# EAGLE board CC-Multi-Pak (EAGLE 5.10)
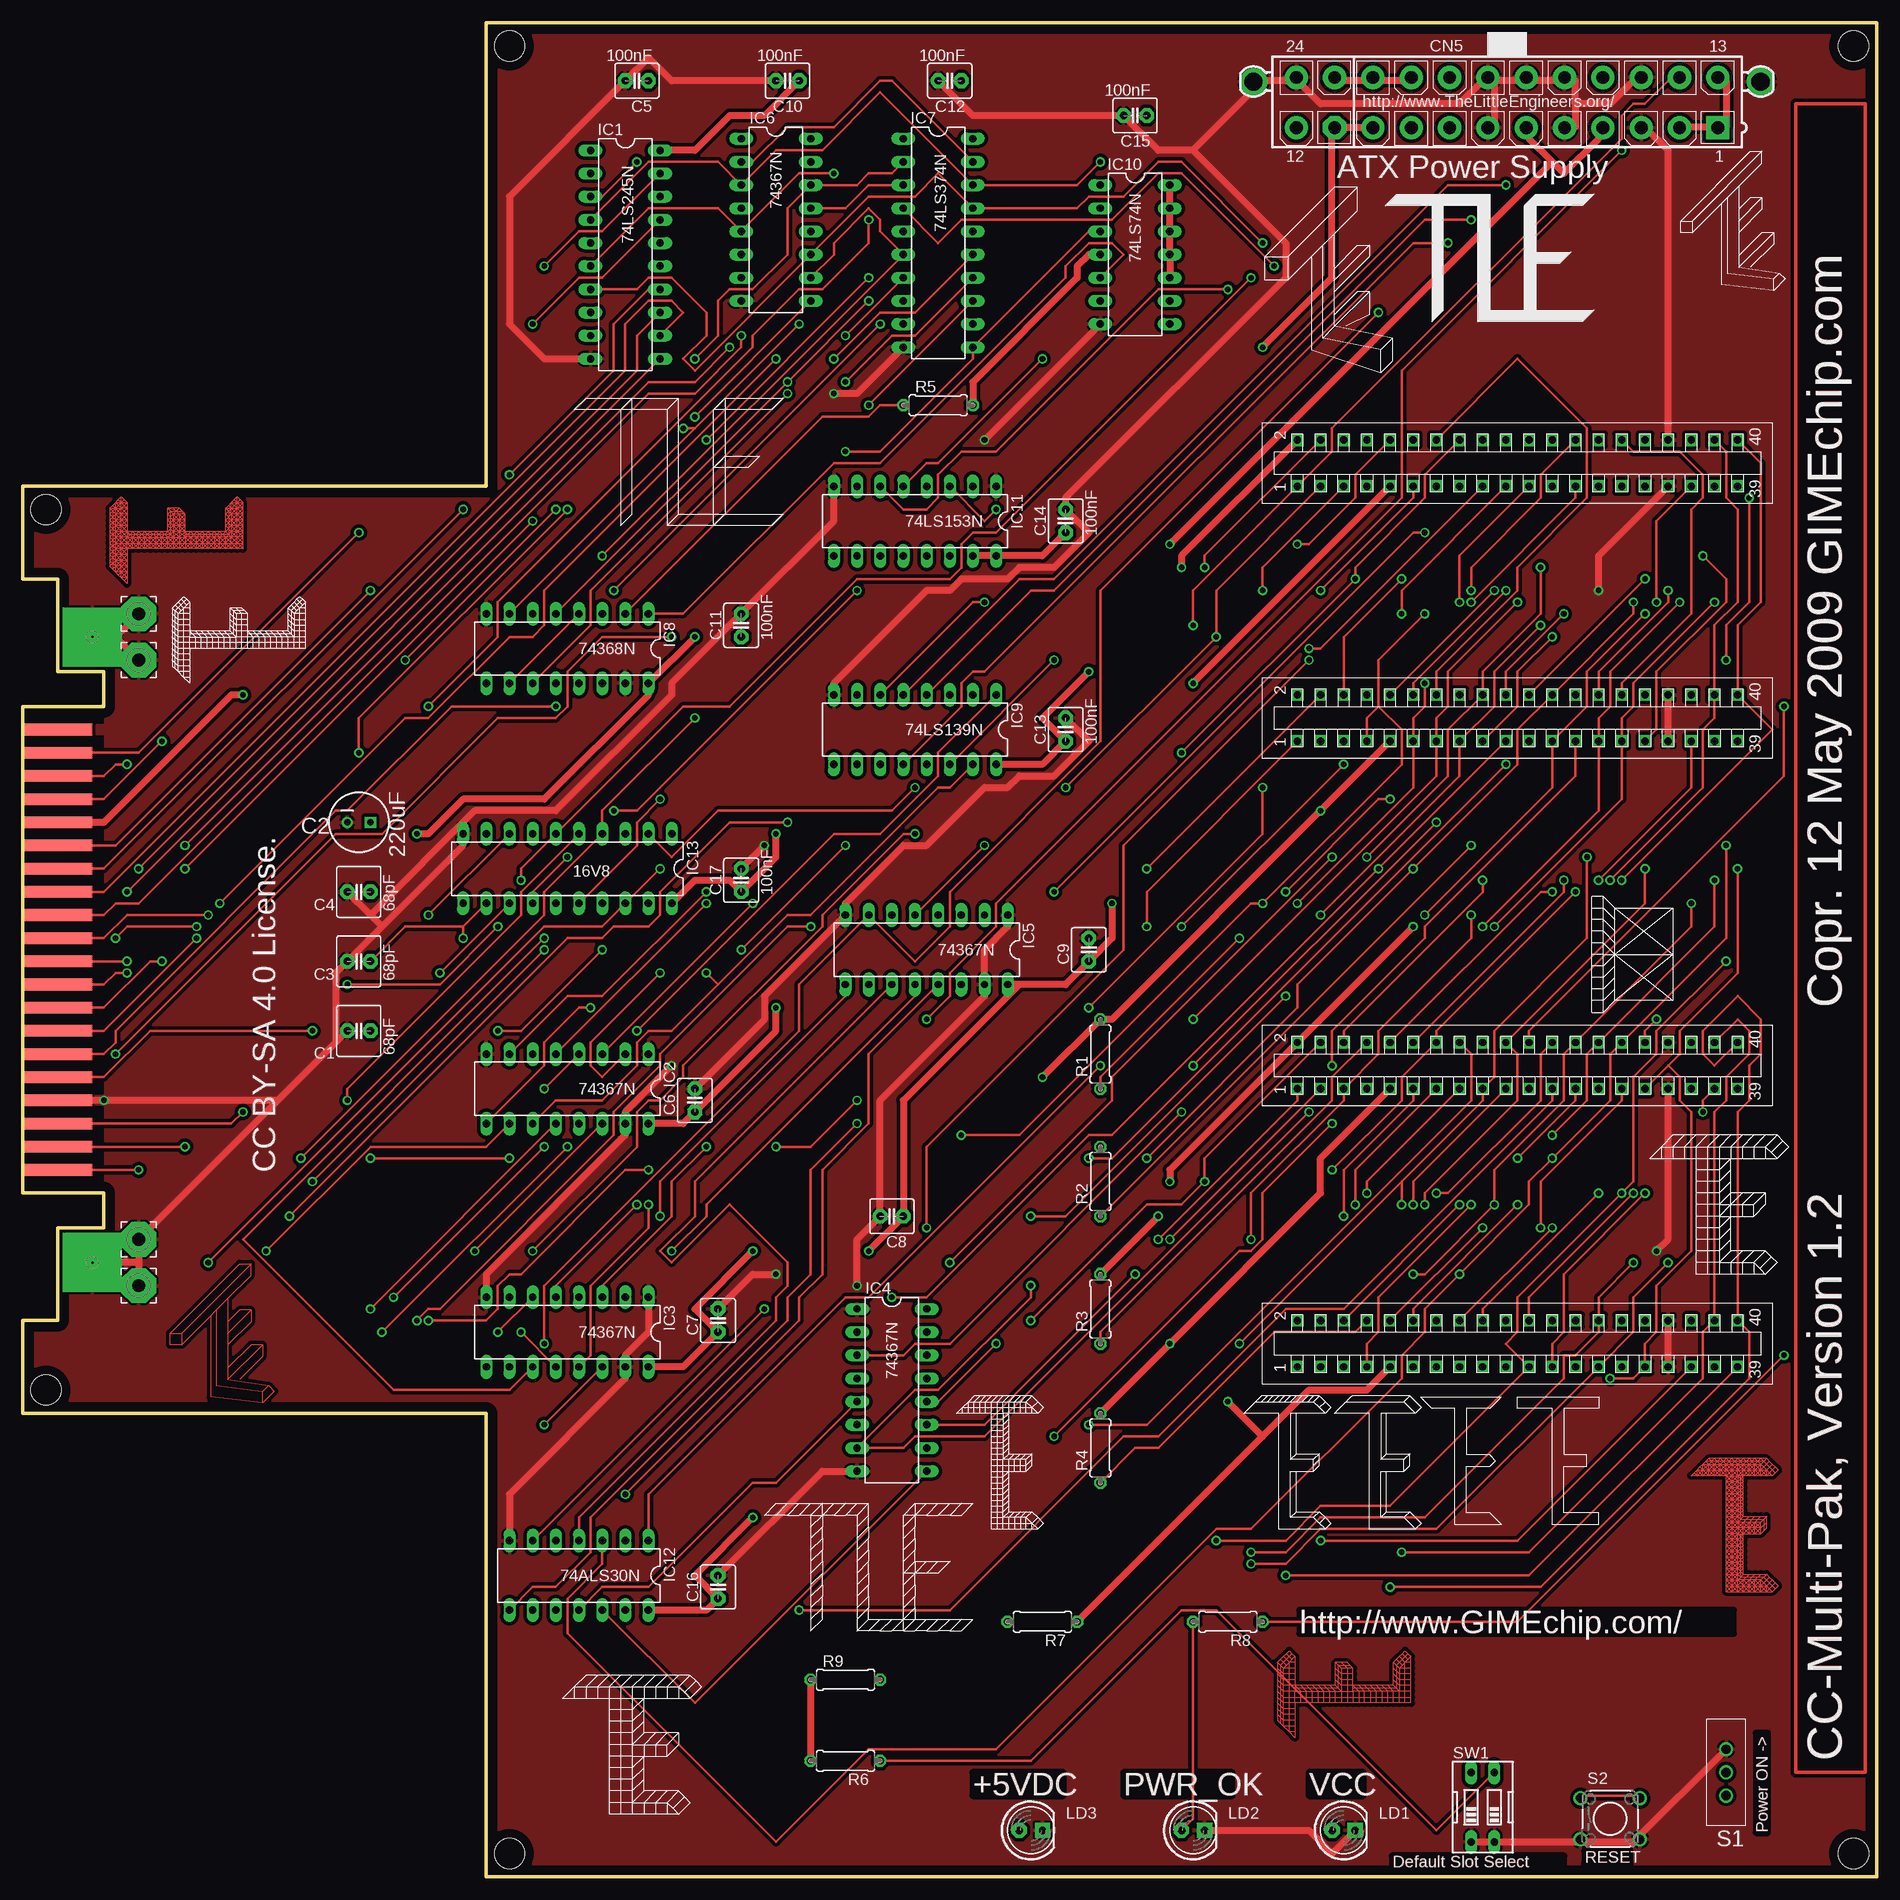
[diagram p8: board, top side]
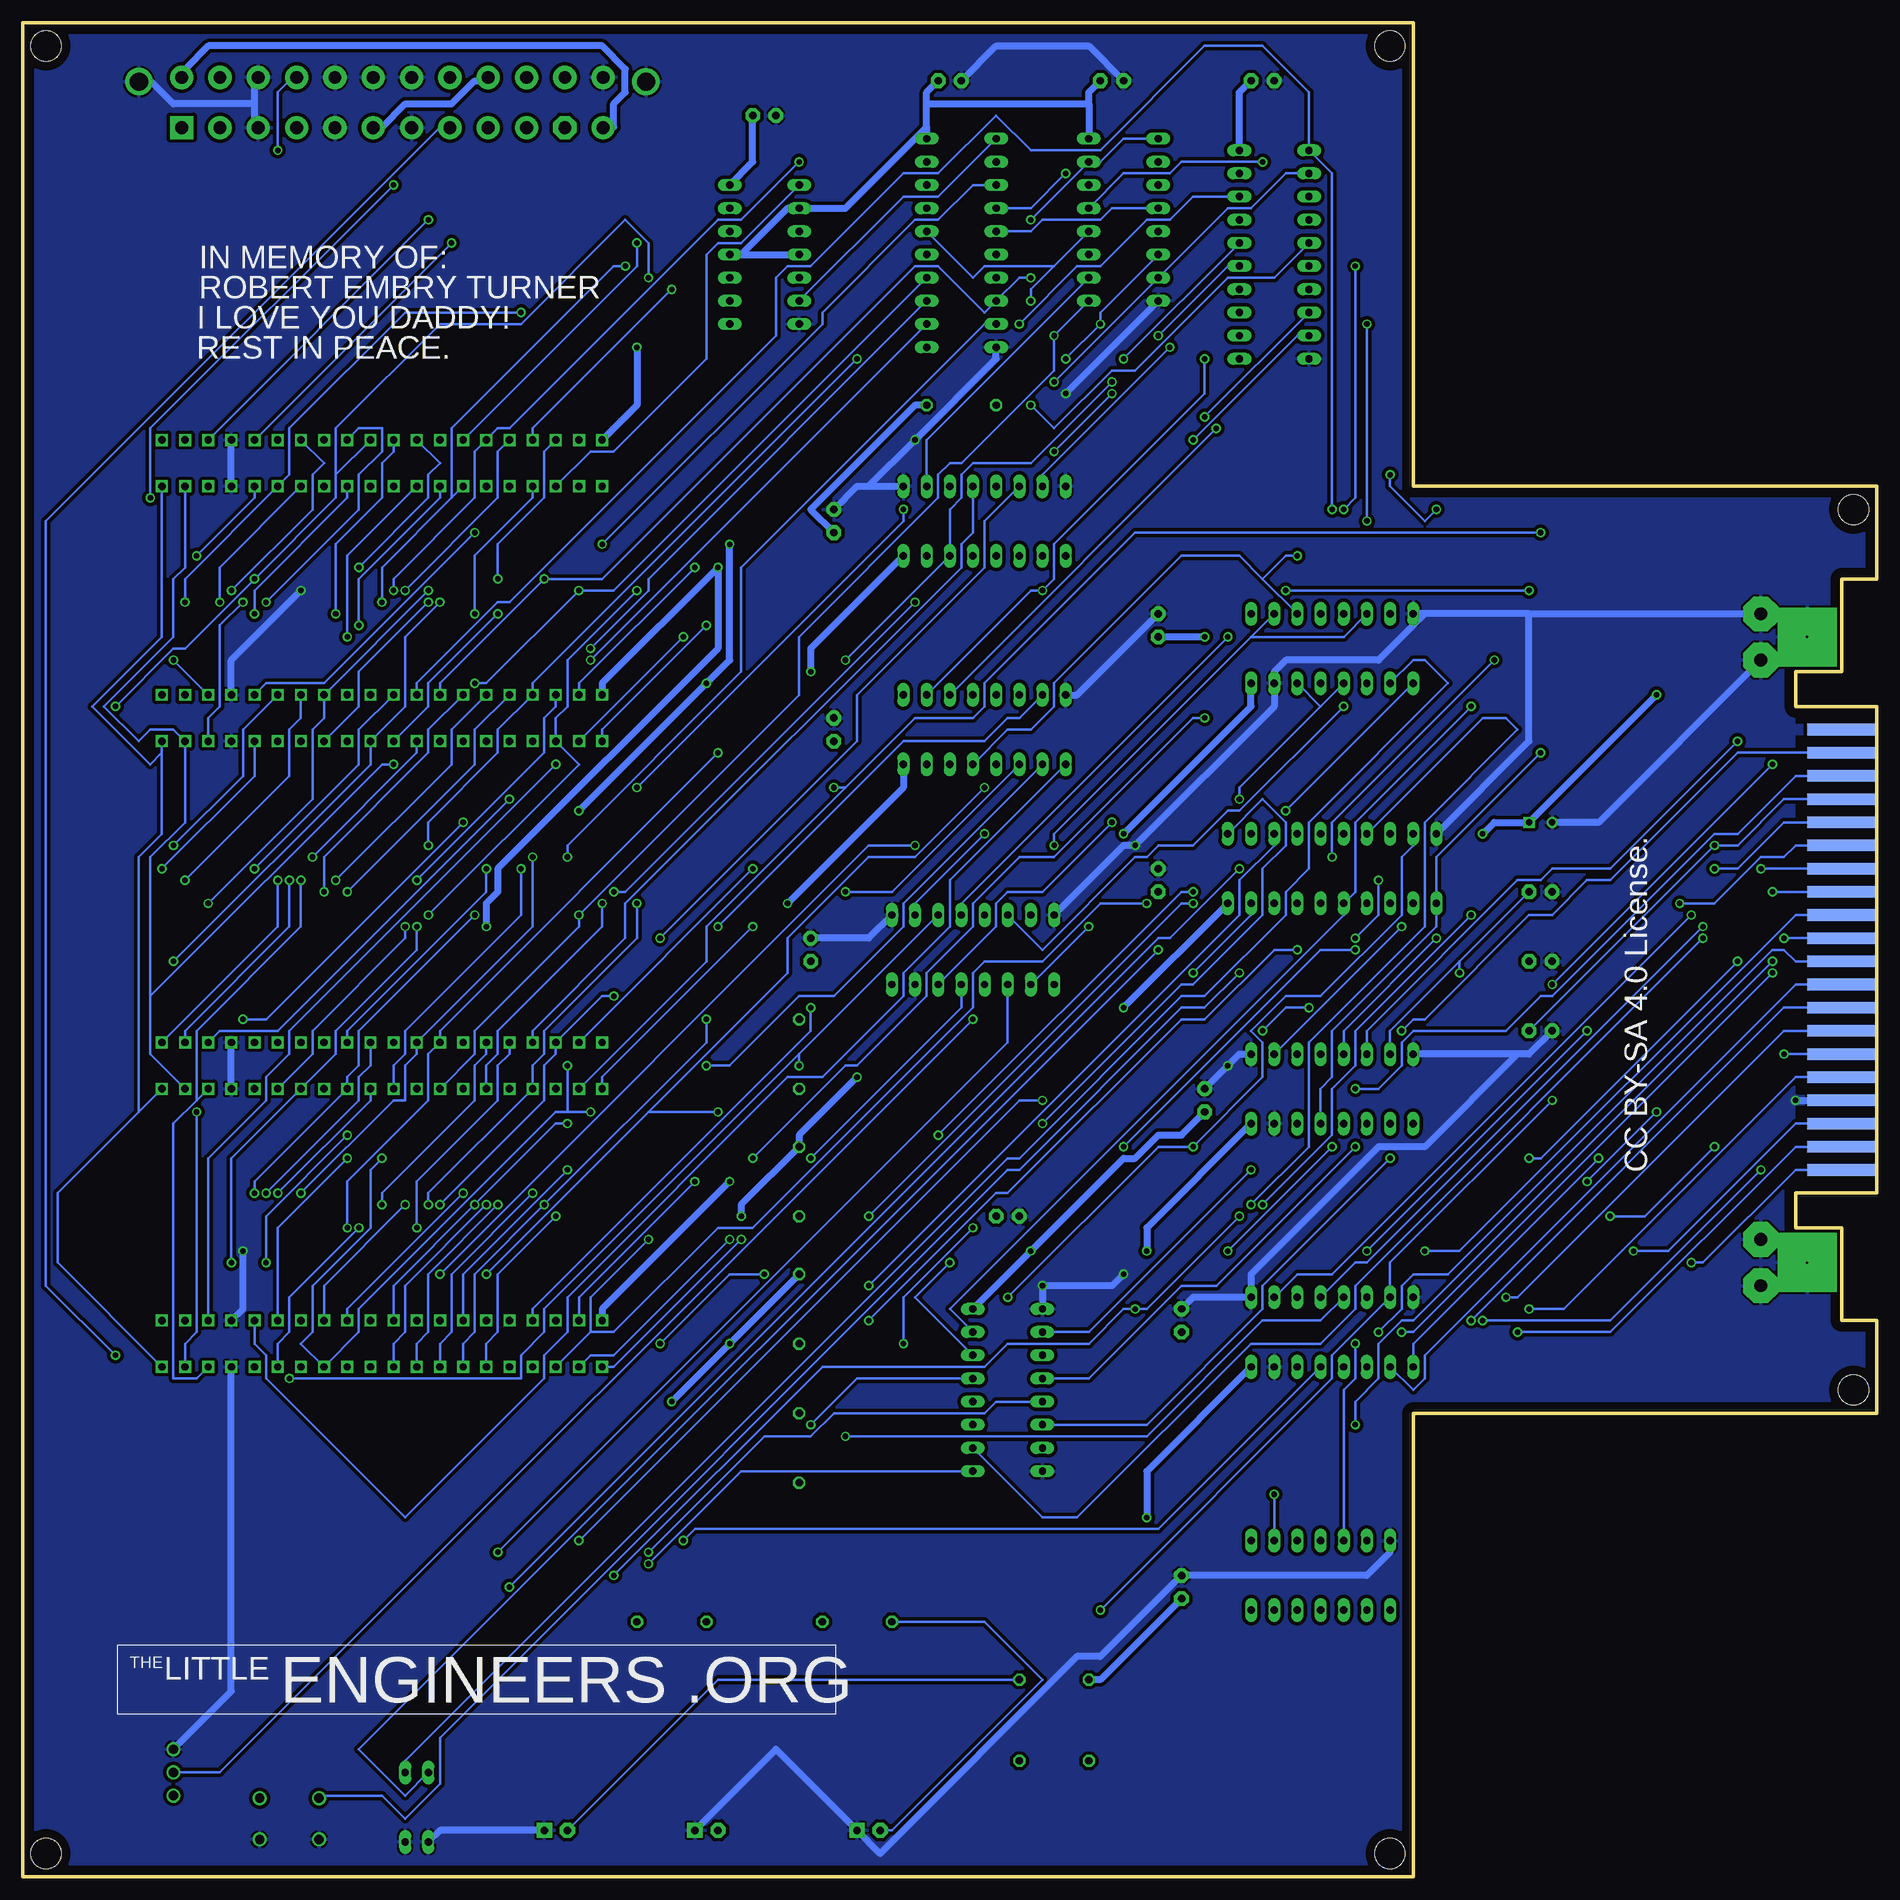
[diagram p9: board, bottom side, seen from below]

Size 203.2 x 203.2 mm. Coordinates in mm from the lower left corner, seen from the top.
Outline: 8.89,71.12 8.89,74.93 0,74.93 0,128.27 8.89,128.27 8.89,132.08 3.81,132.08 3.81,142.24 0,142.24 0,152.4 50.8,152.4 50.8,203.2 203.2,203.2 203.2,0 50.8,0 50.8,50.8 0,50.8 0,60.96 3.81,60.96 3.81,71.12 8.89,71.12
Copper layers (1*16): Top 0.035mm / dielectric 1.5mm / Bottom 0.035mm
Design rules "default": minimum track width 10mil, minimum drill 24mil, track to track 8mil, track to pad 8mil, pad to pad 8mil, via to via 8mil, smd to smd 8mil, copper to edge 40mil, drill to drill 8mil, minimum pad ring 10mil, minimum via ring 8mil, stop-mask expansion 4mil, vias tented up to drill 0mil, thermal gap 10mil
Net classes: 0 default: width 0.254 mm, drill 0.508 mm, clearance 0.254 mm; 1 vcc: width 0.762 mm, drill 0.508 mm, clearance 0.381 mm; 2 gnd: width 0.762 mm, drill 0.508 mm, clearance 0.381 mm; 3 12v: width 0.762 mm, drill 0.508 mm, clearance 0.381 mm; 4 -12v: width 0.762 mm, drill 0.508 mm, clearance 0.381 mm; 5 3.3v: width 0.762 mm, drill 0.508 mm, clearance 0.381 mm; 6 5v: width 0.762 mm, drill 0.381 mm, clearance 0.381 mm; 7 -5v: width 0.762 mm, drill 0.381 mm, clearance 0.381 mm

## Footprints (pad centres in the part's own frame; a part is rotated, then mirrored left to right if it is on the bottom)
C2.5-6 = drill 0.813 pad 1.6 octagon: 1 -1.27,0; 2 1.27,0
SPARKFUN_CPOL-RADIAL-100UF-25V = drill 0.7 square: 1 1.27,0 | drill 0.7 round: 2 -1.27,0
C2.5-4 = drill 0.813 pad 1.6 octagon: 1 -1.27,0; 2 1.27,0
EDGE-CON-40 = drill 0.8 square: P1 -6.35,22.86; P2 -1.27,22.86; P3 -6.35,20.32; P4 -1.27,20.32; P5 -6.35,17.78; P6 -1.27,17.78; P7 -6.35,15.24; P8 -1.27,15.24; P9 -6.35,12.7; P10 -1.27,12.7; P11 -6.35,10.16; P12 -1.27,10.16; P13 -6.35,7.62; P14 -1.27,7.62; P15 -6.35,5.08; P16 -1.27,5.08; P17 -6.35,2.54; P18 -1.27,2.54; P19 -6.35,0; P20 -1.27,0; P21 -6.35,-2.54; P22 -1.27,-2.54; P23 -6.35,-5.08; P24 -1.27,-5.08; P25 -6.35,-7.62; P26 -1.27,-7.62; P27 -6.35,-10.16; P28 -1.27,-10.16; P29 -6.35,-12.7; P30 -1.27,-12.7; P31 -6.35,-15.24; P32 -1.27,-15.24; P33 -6.35,-17.78; P34 -1.27,-17.78; P35 -6.35,-20.32; P36 -1.27,-20.32; P37 -6.35,-22.86; P38 -1.27,-22.86; P39 -6.35,-25.4; P40 -1.27,-25.4
ATX-UNIVERSAL = drill 1.4 pad 2.54 square: 1 23.227,-2.598 | drill 1.4 pad 2.54 round: 2 19.027,-2.598; 3 14.827,-2.598; 4 10.627,-2.598; 5 6.427,-2.598; 6 2.227,-2.598; 7 -1.973,-2.598; 8 -6.173,-2.598; 9 -10.373,-2.598; 10 -14.573,-2.598; 12 -22.973,-2.598; 13 23.227,2.902; 14 19.027,2.902; 15 14.827,2.902; 16 10.627,2.902; 17 6.427,2.902; 18 2.227,2.902; 19 -1.973,2.902; 20 -6.173,2.902; 21 -10.373,2.902; 22 -14.573,2.902; 23 -18.773,2.902; 24 -22.973,2.902 | drill 1.4 pad 2.54 octagon: 11 -18.773,-2.598 | drill 2 round: 25 -27.668,2.438; 26 27.922,2.441
SQUARE = drill 0.254 pad 6.452 square: GND 0,0
DIL20 = drill 0.813 long: 1 -11.43,-3.81; 2 -8.89,-3.81; 3 -6.35,-3.81; 4 -3.81,-3.81; 5 -1.27,-3.81; 6 1.27,-3.81; 7 3.81,-3.81; 8 6.35,-3.81; 9 8.89,-3.81; 10 11.43,-3.81; 11 11.43,3.81; 12 8.89,3.81; 13 6.35,3.81; 14 3.81,3.81; 15 1.27,3.81; 16 -1.27,3.81; 17 -3.81,3.81; 18 -6.35,3.81; 19 -8.89,3.81; 20 -11.43,3.81
DIL16 = drill 0.813 long: 1 -8.89,-3.81; 2 -6.35,-3.81; 3 -3.81,-3.81; 4 -1.27,-3.81; 5 1.27,-3.81; 6 3.81,-3.81; 7 6.35,-3.81; 8 8.89,-3.81; 9 8.89,3.81; 10 6.35,3.81; 11 3.81,3.81; 12 1.27,3.81; 13 -1.27,3.81; 14 -3.81,3.81; 15 -6.35,3.81; 16 -8.89,3.81
DIL14 = drill 0.813 long: 1 -7.62,-3.81; 2 -5.08,-3.81; 3 -2.54,-3.81; 4 0,-3.81; 5 2.54,-3.81; 6 5.08,-3.81; 7 7.62,-3.81; 8 7.62,3.81; 9 5.08,3.81; 10 2.54,3.81; 11 0,3.81; 12 -2.54,3.81; 13 -5.08,3.81; 14 -7.62,3.81
LED5MM = drill 0.813 pad 1.676 octagon: A -1.27,0 | drill 0.813 pad 1.676 square: K 1.27,0
3,81/1,4 = drill 1.397 pad 3.81 octagon: 1 0,0
0207/7 = drill 0.813 octagon: 1 -3.81,0; 2 3.81,0
SWITCH-SPST = drill 1.016 round: 1 0,2.54; 2 0,0; 3 0,-2.54
TACTILE-PTH = drill 1.016 round: 1 -3.251,2.261; 2 3.251,2.261; 3 -3.251,-2.261; 4 3.251,-2.261
DIPSWITCH-02 = drill 0.813 long: 1 -1.27,-3.81; 2 1.27,-3.81; 3 1.27,3.81; 4 -1.27,3.81
SERIALTECH_EDGE40 = smd 7.62 x 1.27: 1 0,24.13; 3 0,21.59; 5 0,19.05; 7 0,16.51; 9 0,13.97; 11 0,11.43; 13 0,8.89; 15 0,6.35; 17 0,3.81; 19 0,1.27; 21 0,-1.27; 23 0,-3.81; 25 0,-6.35; 27 0,-8.89; 29 0,-11.43; 31 0,-13.97; 33 0,-16.51; 35 0,-19.05; 37 0,-21.59; 39 0,-24.13 | smd 7.62 x 1.27 bottom: 2 0,24.13; 4 0,21.59; 6 0,19.05; 8 0,16.51; 10 0,13.97; 12 0,11.43; 14 0,8.89; 16 0,6.35; 18 0,3.81; 20 0,1.27; 22 0,-1.27; 24 0,-3.81; 26 0,-6.35; 28 0,-8.89; 30 0,-11.43; 32 0,-13.97; 34 0,-16.51; 36 0,-19.05; 38 0,-21.59; 40 0,-24.13
SPARKFUN_STAND-OFF = hole 3.302: 0,0

## Placement (x,y rotation side)
C1  68pF  [C2.5-6]  36.83,92.71 0 top
C2  220uF  [SPARKFUN_CPOL-RADIAL-100UF-25V]  36.83,115.57 0 top
C3  68pF  [C2.5-6]  36.83,100.33 180 top
C4  68pF  [C2.5-6]  36.83,107.95 180 top
C5  100nF  [C2.5-4]  67.31,196.85 180 top
C6  100nF  [C2.5-4]  73.66,85.09 90 top
C7  100nF  [C2.5-4]  76.2,60.96 90 top
C8  100nF  [C2.5-4]  95.25,72.39 180 top
C9  100nF  [C2.5-4]  116.84,101.6 90 top
C10  100nF  [C2.5-4]  83.82,196.85 180 top
C11  100nF  [C2.5-4]  78.74,137.16 90 top
C12  100nF  [C2.5-4]  101.6,196.85 180 top
C13  100nF  [C2.5-4]  114.3,125.73 90 top
C14  100nF  [C2.5-4]  114.3,148.59 90 top
C15  100nF  [C2.5-4]  121.92,193.04 180 top
C16  100nF  [C2.5-4]  76.2,31.75 90 top
C17  100nF  [C2.5-4]  78.74,109.22 90 top
CN1  DRAGON-CARD-EDGE  [EDGE-CON-40]  162.56,158.75 90 top
CN2  DRAGON-CARD-EDGE  [EDGE-CON-40]  162.56,130.81 90 top
CN3  DRAGON-CARD-EDGE  [EDGE-CON-40]  162.56,92.71 90 top
CN4  DRAGON-CARD-EDGE  [EDGE-CON-40]  162.56,62.23 90 top
CN5  [ATX-UNIVERSAL]  162.56,194.31 0 top
GND8  GROUNDING-SQUARE  [SQUARE]  7.62,135.89 0 top
GND9  GROUNDING-SQUARE  [SQUARE]  7.62,67.31 0 top
IC1  74LS245N  [DIL20]  66.04,177.8 270 top
IC2  74367N  [DIL16]  59.69,86.36 180 top
IC3  74367N  [DIL16]  59.69,59.69 180 top
IC4  74367N  [DIL16]  95.25,53.34 270 top
IC5  74367N  [DIL16]  99.06,101.6 180 top
IC6  74367N  [DIL16]  82.55,181.61 270 top
IC7  74LS374N  [DIL20]  100.33,179.07 270 top
IC8  74368N  [DIL16]  59.69,134.62 180 top
IC9  74LS139N  [DIL16]  97.79,125.73 180 top
IC10  74LS74N  [DIL14]  121.92,177.8 270 top
IC11  74LS153N  [DIL16]  97.79,148.59 180 top
IC12  74ALS30N  [DIL14]  60.96,33.02 180 top
IC13  16V8  [DIL20]  59.69,110.49 180 top
LD1  [LED5MM]  144.78,5.08 0 top
LD2  [LED5MM]  128.27,5.08 0 top
LD3  [LED5MM]  110.49,5.08 0 top
PAD1  [3,81/1,4]  12.7,138.43 0 top
PAD2  [3,81/1,4]  12.7,133.35 0 top
PAD3  [3,81/1,4]  12.7,69.85 0 top
PAD4  [3,81/1,4]  12.7,64.77 0 top
R1  10K  [0207/7]  118.11,90.17 90 top
R2  10K  [0207/7]  118.11,76.2 90 top
R3  10K  [0207/7]  118.11,62.23 90 top
R4  10K  [0207/7]  118.11,46.99 90 top
R5  4K3  [0207/7]  100.33,161.29 0 top
R6  4K3  [0207/7]  90.17,12.7 180 top
R7  180R  [0207/7]  111.76,27.94 180 top
R8  180R  [0207/7]  132.08,27.94 180 top
R9  180R  [0207/7]  90.17,21.59 0 top
S1  [SWITCH-SPST]  186.69,11.43 180 top
S2  [TACTILE-PTH]  173.99,6.35 0 top
SW1  [DIPSWITCH-02]  160.02,7.62 0 top
U$1  SERIALTECH_COCO_CARTRIDGE  [SERIALTECH_EDGE40]  3.81,101.6 0 top
U$2  SPARKFUN_STAND-OFF  [SPARKFUN_STAND-OFF]  53.34,200.66 0 top
U$3  SPARKFUN_STAND-OFF  [SPARKFUN_STAND-OFF]  200.66,2.54 0 top
U$4  SPARKFUN_STAND-OFF  [SPARKFUN_STAND-OFF]  2.54,149.86 0 top
U$5  SPARKFUN_STAND-OFF  [SPARKFUN_STAND-OFF]  2.54,53.34 0 top
U$6  SPARKFUN_STAND-OFF  [SPARKFUN_STAND-OFF]  53.34,2.54 0 top
U$7  SPARKFUN_STAND-OFF  [SPARKFUN_STAND-OFF]  200.66,200.66 0 top
U$8  [TLE-LOGO-16]  64.26,6.86 0 top
U$9  [TLE-LOGO-15]  150.11,175.01 0 top
U$10  [TLE-LOGO-14]  154.43,170.43 0 top
U$11  [TLE-LOGO-13]  186.18,174.5 0 top
U$12  [TLE-LOGO-12-TCOPPER]  24.13,141.73 90 top
U$13  [TLE-LOGO-13-TCOPPER]  20.57,52.58 0 top
U$14  [TLE-LOGO-11-TCOPPER]  182.88,31.24 0 top
U$15  [TLE-LOGO-10]  30.99,130.81 90 top
U$16  [TLE-LOGO-10-TCOPPER]  152.15,15.24 90 top
U$17  [TLE-LOGO-9]  102.36,38.1 0 top
U$18  [TLE-LOGO-8]  133.86,38.1 0 top
U$19  [TLE-LOGO-7]  143.76,38.1 0 top
U$20  [TLE-LOGO-6]  153.16,38.61 0 top
U$21  [TLE-LOGO-5]  163.83,38.61 0 top
U$22  [TLE-LOGO-4]  86.36,26.92 0 top
U$23  [TLE-LOGO-3]  70.61,153.16 0 top
U$24  [TLE-LOGO-2]  171.96,94.74 0 top
U$25  [TLE-LOGO-1]  192.79,17.78 0 bottom
U$26  [TLE-LOGO]  183.39,66.04 0 top

## Tracks (layer width: path | path; a pad name or v marks a point on that pad's centre or on a via)
3.3V
  Top 0.762: CN5.2 181.61,191.77 185.42,191.77 CN5.1 186.69,191.77 186.69,196.85 CN5.13
  Bottom 0.762: CN5.12 138.43,191.77 138.43,194.31 137.16,195.58 137.16,198.12 139.7,200.66 182.88,200.66 185.42,198.12 CN5.13
!PS_ON  (via drill 0.61)
  Top 0.254: v99.06,93.98 101.6,96.52 101.6,99.06 106.68,104.14 106.68,106.68 151.13,151.13 151.13,165.1 v175.26,189.23
  Bottom 0.254: S1.2 181.61,11.43 v99.06,93.98 | v175.26,189.23 175.26,195.58 173.99,196.85 CN5.16
+5VDC  (via drill 0.61)
  Top 0.762: CN4.P9 147.32,53.34 140.97,53.34 135.89,48.26 | 135.89,48.26 R7.1 | CN3.P9 142.24,78.74 142.24,74.93 v125.73,58.42 R4.2 | v132.08,52.07 135.89,48.26 | CN5.23 144.78,196.85 147.32,196.85 CN5.22 148.59,196.85 151.13,196.85 CN5.21 | 167.64,187.96 168.91,186.69 172.72,190.5 CN5.4 | 167.64,187.96 165.1,190.5 CN5.6 | CN2.P9 v142.24,116.84 119.38,93.98 R1.2 v111.76,87.63 | CN1.P9 v128.27,130.81 | v125.73,146.05 167.64,187.96 | v124.46,72.39 R3.2
  Bottom 0.762: R3.2 v125.73,58.42 v132.08,52.07 | CN5.21 152.4,196.85 153.67,196.85 156.21,194.31 161.29,194.31 163.83,191.77 CN5.6 | v142.24,116.84 v128.27,130.81 125.73,133.35 v125.73,146.05 | v111.76,87.63 118.11,81.28 R2.2 124.46,73.66 v124.46,72.39
+12V  (via drill 0.61)
  Top 0.762: v125.73,76.2 125.73,77.47 CN3.P2 v152.4,104.14 | CN5.10 147.32,191.77 144.78,191.77 CN5.11 143.51,190.5 143.51,175.26 v135.89,167.64 | v127,143.51 127,144.78 CN1.P2
  Bottom 0.762: CN4.P2 139.7,62.23 v125.73,76.2 | CN2.P2 139.7,130.81 v127,143.51 127,134.62 151.13,110.49 151.13,107.95 152.4,106.68 v152.4,104.14 | v135.89,167.64 135.89,161.29 CN1.P2
-12V  (via drill 0.61)
  Top 0.254: v124.46,69.85 139.7,85.09 CN3.P1 | v128.27,137.16 128.27,140.97 CN1.P1 143.51,156.21 143.51,158.75 175.26,190.5 175.26,193.04 176.53,194.31 177.8,194.31 180.34,196.85 CN5.14 | v123.19,104.14 123.19,107.95 CN2.P1
  Bottom 0.254: CN4.P1 138.43,55.88 v124.46,69.85 | CN2.P1 139.7,125.73 v128.27,137.16 | CN3.P1 139.7,87.63 v123.19,104.14
A0  (via drill 0.61)
  Top 0.254: v20.32,105.41 11.43,105.41 8.89,102.87 U$1.19
  Bottom 0.254: IC3.2 63.5,66.04 59.69,66.04 v20.32,105.41
A1  (via drill 0.61)
  Top 0.254: v19.05,104.14 11.43,104.14 v10.16,102.87
  Bottom 0.254: IC3.4 57.15,67.31 55.88,67.31 v19.05,104.14 | U$1.20 v10.16,102.87
A2  (via drill 0.61)
  Top 0.254: v57.15,49.53 IC3.14 | U$1.21 v11.43,100.33
  Bottom 0.254: v57.15,49.53 57.15,52.07 54.61,54.61 54.61,58.42 52.07,60.96 50.8,60.96 v11.43,100.33
A3  (via drill 0.61)
  Top 0.254: v54.61,59.69 IC3.12
  Bottom 0.254: v54.61,59.69 52.07,62.23 52.07,64.77 50.8,66.04 46.99,66.04 11.43,101.6 10.16,101.6 8.89,100.33 U$1.22
A4  (via drill 0.61)
  Top 0.254: v52.07,59.69 IC3.6 | v11.43,99.06 10.16,99.06 8.89,97.79 U$1.23
  Bottom 0.254: v52.07,59.69 50.8,59.69 v11.43,99.06
A5
  Bottom 0.254: IC3.10 50.8,53.34 49.53,54.61 49.53,57.15 8.89,97.79 U$1.24
A6  (via drill 0.61)
  Top 0.254: v38.1,78.74 v53.34,78.74 | v15.24,100.33 13.97,100.33 8.89,95.25 U$1.25
  Bottom 0.254: IC4.6 80.01,49.53 67.31,62.23 67.31,64.77 v53.34,78.74 | v38.1,78.74 36.83,78.74 v15.24,100.33
A7  (via drill 0.61)
  Top 0.254: v68.58,77.47 66.04,77.47 54.61,66.04 53.34,66.04 52.07,64.77 52.07,62.23 50.8,60.96 v44.45,60.96
  Bottom 0.254: IC4.2 86.36,59.69 v68.58,77.47 | v44.45,60.96 10.16,95.25 U$1.26
A8  (via drill 0.61)
  Top 0.254: v19.05,102.87 8.89,92.71 U$1.27
  Bottom 0.254: IC4.10 91.44,39.37 87.63,39.37 68.58,58.42 60.96,58.42 57.15,62.23 57.15,64.77 v19.05,102.87
A9  (via drill 0.61)
  Top 0.254: v40.64,63.5 v57.15,80.01
  Bottom 0.254: IC4.4 86.36,54.61 76.2,64.77 72.39,64.77 v57.15,80.01 | v40.64,63.5 39.37,63.5 10.16,92.71 U$1.28
A10  (via drill 0.61)
  Top 0.254: v58.42,128.27 46.99,128.27 35.56,116.84 34.29,116.84 10.16,92.71 10.16,91.44 8.89,90.17 U$1.29
  Bottom 0.254: IC5.6 91.44,101.6 81.28,111.76 80.01,111.76 78.74,113.03 74.93,113.03 71.12,116.84 69.85,116.84 v58.42,128.27
A11  (via drill 0.61)
  Top 0.254: v71.12,135.89 63.5,135.89 59.69,132.08 59.69,128.27 58.42,127 52.07,127 39.37,114.3 34.29,114.3 v10.16,90.17
  Bottom 0.254: IC5.4 100.33,106.68 v71.12,135.89 | U$1.30 v10.16,90.17
A12  (via drill 0.61)
  Top 0.254: v97.79,114.3 96.52,114.3 87.63,105.41 87.63,104.14 72.39,88.9 72.39,87.63 69.85,85.09 68.58,85.09 67.31,83.82 67.31,80.01 v55.88,68.58 | v31.75,92.71 13.97,92.71 8.89,87.63 U$1.31
  Bottom 0.254: IC5.2 105.41,106.68 v97.79,114.3 | v31.75,92.71 v55.88,68.58
A13  (via drill 0.61)
  Top 0.254: v83.82,115.57 77.47,115.57 69.85,107.95 69.85,105.41 68.58,104.14 64.77,104.14 63.5,102.87 59.69,102.87 v29.21,72.39 | U$1.37 v17.78,80.01
  Bottom 0.254: IC5.14 96.52,104.14 96.52,106.68 95.25,107.95 91.44,107.95 v83.82,115.57 | v29.21,72.39 25.4,72.39 v17.78,80.01
A14  (via drill 0.61)
  Top 0.254: IC5.12 97.79,96.52 74.93,73.66 74.93,72.39 v71.12,68.58 | v39.37,59.69 v59.69,80.01
  Bottom 0.254: v59.69,80.01 v71.12,68.58 | v39.37,59.69 29.21,59.69 8.89,80.01 U$1.38
A15  (via drill 0.61)
  Top 0.254: v86.36,104.14 83.82,104.14 69.85,90.17 69.85,88.9 64.77,83.82 64.77,81.28 45.72,62.23 44.45,62.23 v43.18,60.96 | U$1.39 v12.7,77.47
  Bottom 0.254: v86.36,104.14 IC5.10 | v43.18,60.96 29.21,60.96 v12.7,77.47
AB0  (via drill 0.61)
  Top 0.254: IC3.3 63.5,64.77 71.12,72.39 71.12,76.2 v74.93,80.01 | v151.13,138.43 151.13,140.97 CN1.P19 | v152.4,73.66 152.4,76.2 CN3.P19 | CN2.P19 v148.59,110.49 119.38,81.28 116.84,81.28 99.06,63.5 v95.25,63.5
  Bottom 0.254: IC13.9 50.8,113.03 52.07,111.76 52.07,105.41 60.96,96.52 64.77,96.52 68.58,92.71 67.31,91.44 67.31,87.63 v74.93,80.01 78.74,80.01 v95.25,63.5 | CN2.P19 158.75,128.27 158.75,130.81 v151.13,138.43 | CN4.P19 162.56,58.42 161.29,59.69 161.29,64.77 v152.4,73.66 | v148.59,110.49 148.59,105.41 161.29,92.71 161.29,90.17 162.56,88.9 CN3.P19
AB1  (via drill 0.61)
  Top 0.254: IC3.5 58.42,64.77 v67.31,73.66 | v44.45,105.41 IC13.8 | CN2.P20 162.56,132.08 v168.91,138.43 | v153.67,73.66 153.67,74.93 163.83,85.09 163.83,90.17 CN3.P20 177.8,106.68 v177.8,110.49 | v113.03,48.26 133.35,68.58 134.62,68.58 135.89,69.85 135.89,74.93 v143.51,82.55
  Bottom 0.254: v67.31,73.66 59.69,81.28 59.69,86.36 57.15,88.9 57.15,92.71 v44.45,105.41 | v168.91,138.43 168.91,146.05 163.83,151.13 163.83,154.94 162.56,156.21 CN1.P20 | CN4.P20 162.56,64.77 v153.67,73.66 144.78,82.55 v143.51,82.55 | CN2.P20 166.37,125.73 166.37,121.92 v177.8,110.49 | IC3.5 60.96,60.96 67.31,60.96 80.01,48.26 v113.03,48.26
AB2  (via drill 0.61)
  Top 0.254: v157.48,139.7 157.48,144.78 CN1.P21 | v130.81,36.83 138.43,36.83 142.24,40.64 149.86,40.64 CN4.P21 162.56,58.42 163.83,59.69 163.83,63.5 v175.26,74.93 176.53,76.2 176.53,87.63 179.07,90.17 179.07,92.71 v186.69,100.33 | v68.58,73.66 68.58,71.12 62.23,64.77 62.23,57.15 IC3.13
  Bottom 0.254: v157.48,139.7 161.29,135.89 161.29,128.27 CN2.P21 165.1,121.92 v186.69,100.33 | v175.26,74.93 165.1,85.09 CN3.P21 | IC3.13 78.74,38.1 129.54,38.1 v130.81,36.83 | IC13.7 43.18,127 40.64,127 39.37,125.73 49.53,115.57 49.53,104.14 62.23,91.44 62.23,80.01 v68.58,73.66
AB3  (via drill 0.61)
  Top 0.254: IC3.11 53.34,53.34 40.64,53.34 24.13,69.85 v57.15,102.87 | v54.61,109.22 54.61,110.49 IC13.6 72.39,128.27 77.47,128.27 91.44,142.24 101.6,142.24 102.87,143.51 102.87,146.05 104.14,147.32 106.68,147.32 v134.62,175.26 | v177.8,142.24 CN2.P22 | CN4.P22 165.1,63.5 v176.53,74.93 | v193.04,128.27 193.04,120.65 165.1,92.71 CN3.P22
  Bottom 0.254: v57.15,102.87 54.61,105.41 v54.61,109.22 | 168.91,153.67 168.91,151.13 v177.8,142.24 185.42,134.62 186.69,134.62 v193.04,128.27 | 168.91,153.67 CN1.P22 | v176.53,74.93 166.37,85.09 166.37,87.63 165.1,88.9 CN3.P22 | v134.62,175.26 134.62,179.07 137.16,181.61 148.59,170.18 157.48,170.18 168.91,158.75 168.91,153.67
AB4  (via drill 0.61)
  Top 0.254: v35.56,85.09 35.56,86.36 54.61,105.41 54.61,107.95 IC13.5 | v177.8,138.43 171.45,132.08 171.45,128.27 CN2.P23 167.64,119.38 v153.67,105.41 | CN4.P23 167.64,58.42 168.91,59.69 168.91,66.04 v177.8,74.93 | v85.09,29.21 101.6,29.21 120.65,48.26 124.46,48.26 138.43,62.23 144.78,62.23 167.64,85.09 CN3.P23
  Bottom 0.254: v35.56,85.09 53.34,67.31 IC3.7 59.69,57.15 59.69,54.61 v85.09,29.21 | v177.8,138.43 177.8,140.97 167.64,151.13 CN1.P23 | v177.8,74.93 177.8,76.2 CN3.P23 167.64,87.63 166.37,88.9 166.37,92.71 v153.67,105.41
AB5  (via drill 0.61)
  Top 0.254: v30.48,78.74 57.15,105.41 57.15,107.95 IC13.4 63.5,116.84 v73.66,127 | v154.94,74.93 156.21,74.93 166.37,85.09 166.37,90.17 CN3.P24 | v176.53,139.7 176.53,138.43 CN2.P24 163.83,125.73 163.83,121.92 v152.4,110.49 139.7,97.79 139.7,95.25 v123.19,78.74
  Bottom 0.254: IC3.9 50.8,58.42 v30.48,78.74 | CN4.P24 167.64,62.23 v154.94,74.93 | v152.4,110.49 152.4,107.95 167.64,92.71 CN3.P24 | CN1.P24 166.37,158.75 163.83,158.75 163.83,156.21 166.37,153.67 166.37,149.86 v176.53,139.7 | v73.66,127 74.93,127 90.17,111.76 93.98,111.76 99.06,106.68 99.06,104.14 104.14,99.06 104.14,96.52 111.76,88.9 113.03,88.9 v123.19,78.74
AB6  (via drill 0.61)
  Top 0.254: v158.75,139.7 170.18,151.13 CN1.P25 | v163.83,78.74 170.18,85.09 CN3.P25 | v140.97,83.82 105.41,48.26 97.79,48.26 96.52,46.99 IC4.7 97.79,53.34 100.33,53.34 110.49,63.5 v110.49,64.77 | CN2.P25 170.18,120.65 153.67,104.14 153.67,102.87 143.51,92.71 v143.51,88.9
  Bottom 0.254: CN2.P25 166.37,128.27 166.37,132.08 v158.75,139.7 | v163.83,78.74 165.1,77.47 165.1,71.12 171.45,64.77 171.45,59.69 172.72,58.42 CN4.P25 166.37,59.69 166.37,62.23 144.78,83.82 143.51,83.82 | 143.51,83.82 v140.97,83.82 | IC13.3 66.04,113.03 69.85,109.22 69.85,105.41 v110.49,64.77 | v143.51,88.9 143.51,83.82
AB7  (via drill 0.61)
  Top 0.254: v158.75,140.97 158.75,143.51 166.37,151.13 166.37,153.67 CN1.P26 | IC4.3 96.52,57.15 97.79,58.42 101.6,58.42 v127,83.82 | v152.4,66.04 153.67,66.04 v161.29,73.66 161.29,77.47 168.91,85.09 168.91,90.17 CN3.P26 182.88,104.14 v182.88,106.68 | IC13.2 71.12,111.76 76.2,116.84 95.25,116.84 v97.79,119.38
  Bottom 0.254: v158.75,140.97 CN2.P26 170.18,127 171.45,125.73 171.45,118.11 v182.88,106.68 | CN4.P26 170.18,64.77 v161.29,73.66 | 134.62,83.82 v127,83.82 | v152.4,66.04 134.62,83.82 | v97.79,119.38 105.41,111.76 110.49,111.76 119.38,102.87 119.38,99.06 134.62,83.82
AB8  (via drill 0.61)
  Top 0.254: IC12.12 73.66,19.05 IC4.9 | v181.61,139.7 173.99,132.08 173.99,128.27 172.72,127 CN2.P27 172.72,116.84 v160.02,104.14 | v180.34,67.31 176.53,63.5 176.53,59.69 CN4.P27 154.94,38.1 142.24,38.1 138.43,34.29 v134.62,34.29
  Bottom 0.254: v181.61,139.7 181.61,143.51 CN1.P27 | v180.34,67.31 180.34,78.74 CN3.P27 168.91,90.17 168.91,92.71 160.02,101.6 v160.02,104.14 | IC4.9 124.46,44.45 v134.62,34.29
AB9  (via drill 0.61)
  Top 0.254: IC12.11 63.5,31.75 68.58,31.75 80.01,43.18 82.55,43.18 IC4.5 | v176.53,67.31 172.72,63.5 CN4.P28 172.72,59.69 170.18,57.15 168.91,57.15 168.91,54.61 153.67,39.37 142.24,39.37 138.43,35.56 v134.62,35.56 | v167.64,81.28 171.45,85.09 171.45,90.17 CN3.P28 185.42,104.14 v185.42,109.22 | v180.34,140.97 180.34,139.7 172.72,132.08 CN2.P28
  Bottom 0.254: v176.53,67.31 176.53,72.39 v167.64,81.28 | CN2.P28 172.72,127 173.99,125.73 173.99,120.65 v185.42,109.22 | CN1.P28 170.18,154.94 171.45,153.67 171.45,149.86 v180.34,140.97 | IC4.5 96.52,52.07 97.79,50.8 114.3,50.8 116.84,48.26 121.92,48.26 v134.62,35.56
AB10  (via drill 0.61)
  Top 0.254: v57.15,58.42 57.15,64.77 85.09,92.71 85.09,97.79 IC5.7 97.79,100.33 101.6,104.14 101.6,107.95 118.11,124.46 118.11,140.97 v148.59,171.45 | v185.42,139.7 176.53,130.81 176.53,128.27 175.26,127 CN2.P29 175.26,118.11 v161.29,104.14 | v166.37,71.12 166.37,76.2 175.26,85.09 CN3.P29
  Bottom 0.254: IC12.5 58.42,53.34 57.15,54.61 v57.15,58.42 | v185.42,139.7 185.42,142.24 CN1.P29 173.99,153.67 173.99,158.75 161.29,171.45 v148.59,171.45 | CN4.P29 175.26,58.42 173.99,59.69 173.99,63.5 v166.37,71.12 | v161.29,104.14 161.29,102.87 171.45,92.71 171.45,90.17 CN3.P29
AB11  (via drill 0.61)
  Top 0.254: CN2.P30 175.26,130.81 182.88,138.43 182.88,149.86 184.15,151.13 184.15,153.67 181.61,156.21 176.53,156.21 CN1.P30 | IC12.3 63.5,34.29 59.69,30.48 59.69,26.67 82.55,3.81 92.71,13.97 106.68,13.97 130.81,38.1 134.62,38.1 151.13,54.61 151.13,57.15 153.67,59.69 153.67,62.23 v157.48,66.04 165.1,73.66 165.1,76.2 v167.64,78.74 173.99,85.09 173.99,90.17 CN3.P30 186.69,102.87 v186.69,113.03 | v105.41,113.03 IC5.5
  Bottom 0.254: CN4.P30 175.26,71.12 v167.64,78.74 | v105.41,113.03 110.49,113.03 v157.48,66.04 | CN2.P30 179.07,125.73 179.07,120.65 v186.69,113.03
AB12  (via drill 0.61)
  Top 0.254: 180.34,88.9 181.61,87.63 181.61,85.09 182.88,83.82 182.88,68.58 179.07,64.77 179.07,59.69 177.8,58.42 CN4.P31 176.53,54.61 v173.99,54.61 | 180.34,88.9 CN3.P31 | v187.96,110.49 187.96,99.06 181.61,92.71 181.61,90.17 180.34,88.9 | v184.15,144.78 186.69,142.24 186.69,139.7 179.07,132.08 179.07,125.73 CN2.P31 | IC12.1 68.58,41.91 90.17,63.5 92.71,63.5 v118.11,88.9
  Bottom 0.254: CN2.P31 177.8,120.65 v187.96,110.49 | CN1.P31 177.8,151.13 v184.15,144.78 | 118.11,90.17 v118.11,88.9 | 118.11,90.17 IC5.3 | v173.99,54.61 148.59,54.61 148.59,57.15 146.05,59.69 146.05,62.23 118.11,90.17
AB13  (via drill 0.61)
  Top 0.254: v66.04,41.91 85.09,60.96 85.09,63.5 87.63,66.04 87.63,77.47 92.71,82.55 92.71,90.17 IC5.13 | v184.15,83.82 184.15,85.09 CN3.P37 | v116.84,78.74 119.38,78.74 v162.56,121.92
  Bottom 0.254: v66.04,41.91 IC12.2 | CN4.P37 185.42,58.42 184.15,59.69 v184.15,83.82 | 189.23,96.52 189.23,90.17 CN3.P37 | 189.23,96.52 189.23,111.76 185.42,115.57 CN2.P37 186.69,125.73 189.23,125.73 190.5,124.46 194.31,128.27 186.69,135.89 186.69,142.24 185.42,143.51 CN1.P37 | IC5.13 100.33,95.25 v116.84,78.74 | v162.56,121.92 163.83,121.92 189.23,96.52
AB14  (via drill 0.61)
  Top 0.254: IC12.4 60.96,39.37 82.55,60.96 82.55,63.5 83.82,64.77 83.82,67.31 77.47,73.66 71.12,67.31 69.85,68.58 73.66,72.39 73.66,76.2 IC5.11 | CN1.P38 186.69,156.21 186.69,151.13 187.96,149.86 187.96,139.7 185.42,137.16 CN2.P38 185.42,127 184.15,125.73 184.15,119.38 v173.99,109.22 | CN3.P38 187.96,93.98 189.23,92.71 189.23,90.17 186.69,87.63 186.69,85.09 185.42,83.82 CN4.P38 184.15,59.69 184.15,54.61 165.1,35.56 v151.13,35.56
  Bottom 0.254: v173.99,109.22 173.99,104.14 185.42,92.71 CN3.P38 | IC5.11 95.25,91.44 v151.13,35.56
AB15  (via drill 0.61)
  Top 0.254: v81.28,62.23 IC12.6 | v69.85,72.39 69.85,76.2 90.17,96.52 IC5.9 | v138.43,33.02 165.1,33.02 CN4.P39
  Bottom 0.254: v69.85,72.39 80.01,62.23 v81.28,62.23 82.55,62.23 86.36,58.42 95.25,58.42 97.79,55.88 115.57,55.88 v138.43,33.02 | CN4.P39 199.39,67.31 199.39,74.93 190.5,83.82 | 190.5,83.82 CN3.P39 | 187.96,123.19 187.96,114.3 190.5,111.76 190.5,83.82 | 187.96,123.19 CN2.P39 | CN1.P39 187.96,135.89 195.58,128.27 189.23,121.92 187.96,123.19
BCTS/  (via drill 0.61)
  Top 0.254: IC2.11 58.42,85.09 63.5,85.09 67.31,88.9 67.31,91.44 68.58,92.71 71.12,92.71 76.2,97.79 | 76.2,97.79 83.82,105.41 86.36,105.41 100.33,119.38 101.6,119.38 IC9.15 | 76.2,97.79 v74.93,99.06
  Bottom 0.254: IC13.19 68.58,105.41 v74.93,99.06
BE  (via drill 0.61)
  Top 0.254: 48.26,104.14 IC13.12 | 48.26,104.14 41.91,104.14 C3.1 | v48.26,102.87 48.26,104.14 | CN2.P6 144.78,135.89 v151.13,142.24 | v157.48,73.66 CN4.P6 | v160.02,109.22 160.02,107.95 144.78,92.71 CN3.P6 | v74.93,106.68 IC2.5 | v110.49,72.39 114.3,72.39 v138.43,96.52
  Bottom 0.254: IC2.5 58.42,92.71 v48.26,102.87 | v151.13,142.24 151.13,146.05 146.05,151.13 146.05,156.21 CN1.P6 | v157.48,73.66 146.05,85.09 146.05,88.9 144.78,90.17 CN3.P6 139.7,96.52 v138.43,96.52 | CN2.P6 144.78,128.27 146.05,127 146.05,123.19 v160.02,109.22 | v74.93,106.68 76.2,106.68 v110.49,72.39
BQ  (via drill 0.61)
  Top 0.254: v45.72,99.06 IC13.13 | CN2.P7 147.32,127 148.59,128.27 | 148.59,128.27 148.59,133.35 v153.67,138.43 | CN4.P7 147.32,58.42 148.59,59.69 148.59,63.5 v158.75,73.66 | 148.59,128.27 151.13,125.73 151.13,121.92 v135.89,106.68 134.62,106.68 109.22,81.28 v102.87,81.28 | IC2.7 59.69,96.52 63.5,96.52 v74.93,107.95
  Bottom 0.254: IC2.7 53.34,92.71 45.72,100.33 | 45.72,100.33 C4.1 | 45.72,100.33 v45.72,99.06 | v153.67,138.43 153.67,144.78 147.32,151.13 CN1.P7 | v158.75,73.66 158.75,74.93 CN3.P7 147.32,88.9 146.05,90.17 146.05,92.71 135.89,102.87 v135.89,106.68 | v74.93,107.95 76.2,107.95 v102.87,81.28
BR/W  (via drill 0.61)
  Top 0.254: CN4.P18 160.02,62.23 v172.72,74.93 | v147.32,111.76 156.21,120.65 156.21,125.73 CN2.P18 160.02,132.08 166.37,138.43 v166.37,143.51 | v36.83,123.19 36.83,127 v59.69,149.86
  Bottom 0.254: IC2.13 60.96,86.36 59.69,87.63 59.69,92.71 48.26,104.14 IC13.11 48.26,111.76 v36.83,123.19 | v172.72,74.93 162.56,85.09 161.29,85.09 161.29,88.9 160.02,90.17 CN3.P18 147.32,104.14 v147.32,111.76 | CN1.P18 157.48,154.94 158.75,153.67 158.75,151.13 v166.37,143.51 | CN2.P18 160.02,130.81 151.13,139.7 149.86,139.7 120.65,168.91 120.65,175.26 119.38,176.53 116.84,176.53 106.68,186.69 102.87,186.69 96.52,193.04 92.71,189.23 85.09,189.23 73.66,200.66 67.31,200.66 62.23,195.58 IC1.1 59.69,186.69 v59.69,149.86
BRESET/  (via drill 0.61)
  Top 0.254: v135.89,140.97 135.89,143.51 CN1.P5 | v134.62,69.85 134.62,74.93 144.78,85.09 CN3.P5 148.59,90.17 148.59,92.71 158.75,102.87 v158.75,105.41 | v80.01,106.68 IC2.3
  Bottom 0.254: v135.89,140.97 143.51,133.35 143.51,128.27 144.78,127 CN2.P5 142.24,121.92 v158.75,105.41 | IC10.1 124.46,179.07 127,179.07 128.27,177.8 128.27,166.37 138.43,156.21 140.97,156.21 CN1.P5 | 140.97,59.69 CN4.P5 | 140.97,59.69 140.97,63.5 v134.62,69.85 | v80.01,106.68 85.09,106.68 91.44,100.33 97.79,100.33 99.06,99.06 99.06,95.25 123.19,71.12 127,71.12 138.43,59.69 140.97,59.69
BSCS/  (via drill 0.61)
  Top 0.254: IC2.9 57.15,88.9 57.15,91.44 60.96,95.25 v62.23,95.25 | v67.31,92.71 88.9,114.3 93.98,114.3 100.33,120.65 100.33,123.19 IC9.1
  Bottom 0.254: v62.23,95.25 64.77,95.25 v67.31,92.71
C0S0
  Top 0.254: IC8.10 IC8.4 | R6.1 110.49,12.7 127,29.21 130.81,29.21 154.94,5.08 SW1.3
  Bottom 0.254: IC8.10 50.8,133.35 49.53,133.35 46.99,130.81 62.23,115.57 62.23,110.49 64.77,107.95 64.77,105.41 73.66,96.52 76.2,96.52 93.98,78.74 95.25,78.74 161.29,12.7 SW1.3
C1S1  (via drill 0.61)
  Top 0.254: v78.74,101.6 v90.17,113.03 | R5.1 93.98,161.29 92.71,160.02 87.63,160.02 IC8.2
  Bottom 0.254: SW1.4 161.29,8.89 166.37,13.97 v78.74,101.6 | v90.17,113.03 90.17,114.3 68.58,135.89 | 68.58,135.89 IC8.2 | IC8.6 58.42,135.89 68.58,135.89
CART0/  (via drill 0.61)
  Top 0.254: v132.08,173.99 124.46,173.99 106.68,156.21 102.87,156.21 100.33,153.67 100.33,151.13 99.06,149.86 96.52,149.86 IC11.6 | R1.1 118.11,87.63 v133.35,102.87
  Bottom 0.254: CN1.P8 147.32,158.75 v132.08,173.99 | v133.35,102.87 111.76,124.46 111.76,129.54 97.79,143.51 97.79,148.59 IC11.6
CART1/  (via drill 0.61)
  Top 0.254: v111.76,166.37 100.33,154.94 99.06,154.94 IC11.5 | R2.1 v158.75,113.03
  Bottom 0.254: v111.76,166.37 147.32,130.81 CN2.P8 151.13,125.73 151.13,123.19 158.75,115.57 v158.75,113.03
CART2/
  Top 0.254: CN3.P8 143.51,87.63 143.51,85.09 118.11,59.69 R3.1
  Bottom 0.254: IC11.4 99.06,147.32 100.33,146.05 100.33,143.51 137.16,106.68 137.16,102.87 147.32,92.71 CN3.P8
CART3/  (via drill 0.61)
  Top 0.254: CN4.P8 146.05,59.69 137.16,59.69 124.46,46.99 121.92,46.99 R4.1 | IC11.3 105.41,148.59 v106.68,149.86 | v135.89,119.38 135.89,114.3 v116.84,95.25
  Bottom 0.254: v106.68,149.86 106.68,148.59 v135.89,119.38 | v116.84,95.25 116.84,92.71 147.32,62.23 CN4.P8
CART*  (via drill 0.61)
  Top 0.254: v77.47,167.64 73.66,163.83 68.58,163.83 v17.78,113.03
  Bottom 0.254: IC11.7 91.44,153.67 v77.47,167.64 | C1.2 v17.78,113.03 15.24,113.03 10.16,118.11 U$1.8
CK0
  Top 0.254: IC6.2 80.01,187.96 83.82,191.77 88.9,191.77 93.98,196.85 95.25,196.85 IC7.19
CK1
  Bottom 0.254: IC6.4 83.82,182.88 85.09,181.61 91.44,181.61 92.71,180.34 IC7.5
CK2  (via drill 0.61)
  Top 0.254: v101.6,67.31 119.38,85.09 119.38,87.63 v143.51,111.76
  Bottom 0.254: IC4.14 105.41,63.5 v101.6,67.31 | v143.51,111.76 143.51,113.03 124.46,132.08 124.46,143.51 97.79,170.18 IC7.9
CK3  (via drill 0.61)
  Top 0.254: IC4.12 100.33,52.07 v106.68,58.42 | v99.06,71.12 99.06,80.01 120.65,101.6 120.65,113.03 v140.97,133.35
  Bottom 0.254: v106.68,58.42 106.68,63.5 v99.06,71.12 | v140.97,133.35 IC7.12
CTS0/  (via drill 0.61)
  Top 0.254: v156.21,179.07 152.4,179.07 105.41,132.08 104.14,132.08 102.87,130.81 102.87,128.27 IC9.12
  Bottom 0.254: v156.21,179.07 CN1.P32
CTS1/  (via drill 0.61)
  Top 0.254: v153.67,147.32 152.4,147.32 v113.03,107.95
  Bottom 0.254: CN2.P32 176.53,130.81 170.18,130.81 v153.67,147.32 | v113.03,107.95 107.95,107.95 IC9.11
CTS2/  (via drill 0.61)
  Top 0.254: CN3.P32 177.8,92.71 v179.07,93.98 | v128.27,88.9 v154.94,115.57
  Bottom 0.254: v179.07,93.98 176.53,93.98 v154.94,115.57 | v128.27,88.9 125.73,88.9 118.11,96.52 114.3,96.52 106.68,104.14 106.68,106.68 IC9.10
CTS3/
  Bottom 0.254: CN4.P32 177.8,58.42 176.53,57.15 176.53,54.61 161.29,39.37 146.05,54.61 146.05,57.15 143.51,59.69 143.51,63.5 119.38,87.63 115.57,87.63 106.68,96.52 106.68,99.06 101.6,104.14 101.6,109.22 IC9.9
CTS*  (via drill 0.61)
  Top 0.254: v38.1,62.23 IC2.12
  Bottom 0.254: v38.1,62.23 34.29,62.23 8.89,87.63 U$1.32
D0  (via drill 0.61)
  Top 0.254: IC1.17 63.5,175.26 60.96,175.26 v55.88,170.18 | v17.78,110.49 v55.88,148.59
  Bottom 0.254: v55.88,148.59 v55.88,170.18 | v17.78,110.49 15.24,110.49 10.16,115.57 U$1.10
D1  (via drill 0.61)
  Top 0.254: v64.77,140.97 v93.98,170.18 | v38.1,140.97 10.16,113.03 U$1.11
  Bottom 0.254: IC1.18 74.93,184.15 77.47,181.61 80.01,181.61 85.09,176.53 87.63,176.53 v93.98,170.18 | v38.1,140.97 v64.77,140.97
D2  (via drill 0.61)
  Top 0.254: v82.55,166.37 57.15,140.97 57.15,137.16 55.88,135.89 53.34,135.89 44.45,127 41.91,127 v21.59,106.68
  Bottom 0.254: v82.55,166.37 IC1.16 | v21.59,106.68 17.78,106.68 12.7,111.76 10.16,111.76 8.89,113.03 U$1.12
D3  (via drill 0.61)
  Top 0.254: IC1.14 68.58,173.99 64.77,170.18 64.77,165.1 v53.34,153.67 | v48.26,149.86 8.89,110.49 U$1.13
  Bottom 0.254: v53.34,153.67 53.34,152.4 49.53,148.59 v48.26,149.86
D4  (via drill 0.61)
  Top 0.254: IC1.13 67.31,168.91 67.31,165.1 v12.7,110.49
  Bottom 0.254: U$1.14 v12.7,110.49
D5
  Top 0.254: IC1.12 72.39,171.45 71.12,172.72 68.58,172.72 66.04,170.18 66.04,165.1 8.89,107.95 U$1.15
D6  (via drill 0.61)
  Top 0.254: v11.43,107.95 IC1.11
  Bottom 0.254: U$1.16 v11.43,107.95
D7  (via drill 0.61)
  Top 0.254: v78.74,168.91 78.74,167.64 73.66,162.56 68.58,162.56 12.7,106.68 10.16,106.68 8.89,105.41 U$1.17
  Bottom 0.254: IC1.15 71.12,176.53 v78.74,168.91
DB0  (via drill 0.61)
  Top 0.254: IC6.13 90.17,182.88 92.71,185.42 IC7.3 | IC1.3 63.5,184.15 v67.31,187.96 | v161.29,140.97 CN2.P10 | v160.02,71.12 CN4.P10 | v167.64,107.95 166.37,107.95 CN3.P10 | v139.7,146.05 140.97,146.05 146.05,151.13 146.05,153.67 CN1.P10
  Bottom 0.254: v67.31,187.96 76.2,187.96 77.47,186.69 82.55,186.69 IC6.13 | v161.29,140.97 151.13,151.13 151.13,156.21 CN1.P10 | v160.02,71.12 160.02,76.2 151.13,85.09 151.13,88.9 149.86,90.17 CN3.P10 | CN2.P10 153.67,125.73 153.67,121.92 v167.64,107.95 | IC7.3 99.06,185.42 102.87,181.61 105.41,181.61 115.57,171.45 115.57,170.18 v139.7,146.05
DB1  (via drill 0.61)
  Top 0.254: v144.78,72.39 144.78,77.47 152.4,85.09 CN3.P11 | v139.7,106.68 152.4,119.38 CN2.P11 152.4,127 153.67,128.27 v153.67,130.81 | CN1.P11 152.4,151.13 v142.24,140.97 | v90.17,163.83 95.25,168.91 97.79,168.91 IC7.14
  Bottom 0.254: CN4.P11 152.4,58.42 151.13,59.69 151.13,66.04 v144.78,72.39 | v139.7,106.68 139.7,104.14 151.13,92.71 151.13,90.17 152.4,88.9 CN3.P11 | IC1.2 64.77,186.69 68.58,182.88 71.12,182.88 IC6.7 v90.17,163.83 | IC7.14 138.43,140.97 v142.24,140.97 152.4,130.81 v153.67,130.81
DB2  (via drill 0.61)
  Top 0.254: IC1.4 68.58,187.96 76.2,187.96 IC6.3 82.55,189.23 87.63,189.23 93.98,195.58 IC7.18 115.57,185.42 v118.11,187.96 | CN2.P12 152.4,130.81 v162.56,140.97 | CN4.P12 152.4,62.23 v163.83,73.66 | v168.91,109.22 168.91,107.95 CN3.P12
  Bottom 0.254: v162.56,140.97 162.56,142.24 153.67,151.13 153.67,156.21 CN1.P12 151.13,158.75 149.86,158.75 127,181.61 124.46,181.61 v118.11,187.96 | v163.83,73.66 163.83,74.93 153.67,85.09 153.67,88.9 152.4,90.17 CN3.P12 | CN2.P12 156.21,125.73 156.21,121.92 v168.91,109.22
DB3  (via drill 0.61)
  Top 0.254: IC1.6 68.58,182.88 76.2,182.88 IC6.5 85.09,186.69 v88.9,186.69 | v163.83,139.7 156.21,132.08 156.21,128.27 154.94,127 CN2.P13 154.94,120.65 v128.27,93.98 | v146.05,73.66 146.05,77.47 CN3.P13 | IC7.4 100.33,179.07 102.87,181.61 119.38,181.61 124.46,186.69 127,186.69 v137.16,176.53
  Bottom 0.254: IC7.4 92.71,182.88 v88.9,186.69 | v163.83,139.7 163.83,143.51 156.21,151.13 | 156.21,151.13 CN1.P13 | CN4.P13 154.94,58.42 153.67,59.69 153.67,66.04 v146.05,73.66 128.27,91.44 v128.27,93.98 | v137.16,176.53 138.43,176.53 156.21,158.75 156.21,151.13
DB4  (via drill 0.61)
  Top 0.254: IC1.7 67.31,173.99 68.58,175.26 71.12,175.26 74.93,171.45 74.93,168.91 72.39,166.37 73.66,165.1 IC6.11 92.71,184.15 97.79,184.15 100.33,186.69 IC7.17 115.57,182.88 116.84,184.15 120.65,184.15 124.46,187.96 127,187.96 v135.89,179.07 | v143.51,77.47 151.13,85.09 151.13,87.63 CN3.P14 154.94,92.71 v170.18,107.95 | CN2.P14 154.94,132.08 163.83,140.97 163.83,143.51 171.45,151.13 171.45,158.75 163.83,166.37 CN1.P14
  Bottom 0.254: CN4.P14 154.94,66.04 v143.51,77.47 | v170.18,107.95 170.18,111.76 158.75,123.19 158.75,125.73 CN2.P14 | v135.89,179.07 135.89,176.53 CN1.P14
DB5  (via drill 0.61)
  Top 0.254: IC6.9 v73.66,160.02 | v90.17,168.91 IC7.7 | v166.37,137.16 161.29,132.08 161.29,128.27 CN2.P15 157.48,120.65 v142.24,105.41 | v147.32,74.93 147.32,76.2 CN3.P15
  Bottom 0.254: v73.66,160.02 IC1.8 | IC6.9 v90.17,168.91 90.17,165.1 100.33,154.94 101.6,154.94 102.87,153.67 102.87,151.13 118.11,135.89 118.11,129.54 v142.24,105.41 142.24,104.14 153.67,92.71 153.67,90.17 CN3.P15 | v166.37,137.16 166.37,142.24 157.48,151.13 CN1.P15 | CN4.P15 157.48,58.42 156.21,59.69 156.21,66.04 v147.32,74.93
DB6  (via drill 0.61)
  Top 0.254: v167.64,71.12 CN4.P16 | v116.84,49.53 123.19,49.53 158.75,85.09 158.75,90.17 CN3.P16 | CN1.P16 153.67,153.67 153.67,151.13 146.05,143.51 v146.05,142.24 v127,123.19 | v92.71,175.26 v74.93,157.48
  Bottom 0.254: v167.64,71.12 167.64,76.2 158.75,85.09 158.75,90.17 CN3.P16 157.48,92.71 v127,123.19 | IC4.13 111.76,54.61 v116.84,49.53 | CN2.P16 157.48,130.81 v146.05,142.24 139.7,142.24 105.41,176.53 102.87,176.53 97.79,171.45 IC7.8 93.98,175.26 v92.71,175.26 | IC1.9 63.5,168.91 v74.93,157.48
DB7  (via drill 0.61)
  Top 0.254: IC7.13 v92.71,161.29 | CN2.P17 163.83,128.27 163.83,132.08 v167.64,135.89 | 151.13,76.2 v151.13,73.66 | 151.13,76.2 160.02,85.09 CN3.P17 161.29,87.63 161.29,92.71 171.45,102.87 v171.45,111.76 | IC4.11 105.41,49.53 v121.92,66.04 | 151.13,76.2 v133.35,58.42 | v140.97,134.62 142.24,134.62 CN1.P17
  Bottom 0.254: v92.71,161.29 90.17,158.75 83.82,165.1 81.28,165.1 71.12,175.26 66.04,175.26 IC1.5 | v167.64,135.89 167.64,144.78 CN1.P17 | CN4.P17 160.02,58.42 158.75,59.69 158.75,66.04 v151.13,73.66 | v121.92,66.04 125.73,66.04 v133.35,58.42 | CN2.P17 160.02,123.19 v171.45,111.76 | IC7.13 134.62,142.24 134.62,140.97 v140.97,134.62
E  (via drill 0.61)
  Top 0.254: v57.15,86.36 IC2.4
  Bottom 0.254: v57.15,86.36 54.61,86.36 52.07,88.9 52.07,91.44 50.8,92.71 40.64,92.71 36.83,96.52 35.56,96.52 17.78,114.3 15.24,114.3 8.89,120.65 U$1.6
ENBUS/  (via drill 0.61)
  Top 0.254: IC13.14 55.88,107.95 v59.69,111.76 | v41.91,133.35 v58.42,149.86 | v57.15,176.53 60.96,180.34 63.5,180.34 IC1.19
  Bottom 0.254: v59.69,111.76 59.69,115.57 v41.91,133.35 | v58.42,149.86 57.15,151.13 v57.15,176.53
ENREAD/  (via drill 0.61)
  Top 0.254: v92.71,181.61 92.71,179.07 87.63,173.99 85.09,173.99 80.01,168.91 80.01,167.64 52.07,139.7 52.07,135.89 v44.45,128.27
  Bottom 0.254: IC6.1 82.55,190.5 85.09,187.96 IC6.15 v92.71,181.61 | IC4.15 101.6,62.23 58.42,105.41 IC13.15 57.15,107.95 57.15,115.57 v44.45,128.27
ENREG
  Bottom 0.254: IC7.1 102.87,184.15 106.68,184.15 IC10.6
ENSW
  Top 0.254: IC8.1 72.39,138.43 88.9,154.94 93.98,154.94 114.3,175.26 114.3,176.53 116.84,179.07 119.38,179.07 120.65,177.8 IC10.5
GND  (via drill 0.61)
  Top 0.762: v105.41,157.48 IC10.7 | v88.9,162.56 91.44,162.56 IC7.10 | IC1.10 57.15,166.37 53.34,170.18 53.34,184.15 C5.2 68.58,199.39 71.12,196.85 C10.2 | 128.27,189.23 124.46,189.23 C15.2 104.14,193.04 C12.2 | 128.27,189.23 134.62,195.58 CN5.25 135.89,196.85 138.43,196.85 CN5.24 139.7,196.85 142.24,194.31 157.48,194.31 160.02,196.85 CN5.19 | CN2.P33 CN2.P34 | v172.72,140.97 172.72,144.78 CN1.P33 | 170.18,194.31 170.18,196.85 CN5.17 168.91,196.85 165.1,196.85 CN5.18 163.83,196.85 161.29,196.85 | 170.18,194.31 170.18,191.77 CN5.5 | 161.29,196.85 161.29,191.77 CN5.7 | 161.29,196.85 CN5.19 | 161.29,196.85 CN5.19 | 170.18,194.31 173.99,194.31 176.53,196.85 CN5.15 | CN1.P34 180.34,189.23 177.8,191.77 CN5.3 | 128.27,189.23 138.43,179.07 138.43,175.26 114.3,151.13 C14.2 116.84,147.32 113.03,143.51 109.22,143.51 107.95,142.24 102.87,142.24 101.6,140.97 99.06,140.97 88.9,130.81 IC9.8 | 10.16,135.89 GND8.GND 10.16,135.89 | PAD1.1 10.16,135.89 | 10.16,135.89 PAD2.1 | IC3.8 50.8,66.04 66.04,81.28 IC2.15 66.04,83.82 v71.12,88.9 | C6.2 81.28,93.98 81.28,96.52 IC5.8 90.17,106.68 96.52,113.03 99.06,113.03 105.41,119.38 107.95,119.38 109.22,120.65 113.03,120.65 116.84,124.46 C13.2 | v81.28,113.03 C17.2 | SW1.1 SW1.2 170.18,3.81 S2.3 171.45,3.81 176.53,3.81 | CN4.P33 CN4.P34 | 176.53,3.81 S2.4 176.53,3.81 | 176.53,3.81 S1.3 | CN3.P33 180.34,69.85 v179.07,68.58 | LD2.K 140.97,5.08 143.51,2.54 LD1.K | v91.44,64.77 91.44,69.85 C8.2 93.98,85.09 105.41,96.52 IC5.15 105.41,101.6 107.95,104.14 IC5.1 | IC4.8 87.63,44.45 C16.2 | IC12.7 53.34,41.91 66.04,54.61 IC3.15 66.04,57.15 68.58,59.69 IC3.1 | IC11.8 88.9,148.59 C11.2 71.12,130.81 71.12,129.54 58.42,116.84 49.53,116.84 38.1,105.41
  Top 0.762: 12.7,67.31 PAD3.1 27.94,85.09 | 12.7,67.31 PAD4.1 | 12.7,67.31 GND9.GND | IC13.10 48.26,113.03 39.37,104.14 | 39.37,104.14 C3.2 34.29,99.06 34.29,91.44 | 38.1,105.41 39.37,104.14 | 38.1,105.41 C4.2 | 27.94,85.09 v8.89,85.09 U$1.34 | 34.29,91.44 C1.1 | 34.29,91.44 27.94,85.09 | v82.55,66.04 80.01,66.04 C7.2
  Bottom 0.762: 110.49,152.4 111.76,152.4 C14.2 | 110.49,152.4 IC11.1 | IC7.10 96.52,166.37 v105.41,157.48 110.49,152.4 | v88.9,162.56 IC6.8 | CN1.P33 CN1.P34 | CN2.P34 180.34,133.35 v172.72,140.97 | 177.8,194.31 177.8,196.85 CN5.15 | 177.8,194.31 177.8,191.77 CN5.3 | 177.8,194.31 186.69,194.31 189.23,196.85 CN5.26 | C10.2 86.36,200.66 96.52,200.66 C12.2 | C2.2 30.48,115.57 PAD2.1 | 38.1,138.43 PAD1.1 | 38.1,138.43 49.53,138.43 | 49.53,138.43 IC8.8 | 49.53,138.43 54.61,133.35 64.77,133.35 66.04,132.08 IC8.15 66.04,128.27 v81.28,113.03 82.55,113.03 IC5.8 | IC2.1 69.85,90.17 v71.12,88.9 C6.2 | LD2.K 120.65,13.97 LD3.K 109.22,2.54 87.63,24.13 85.09,24.13 C16.2 55.88,33.02 53.34,35.56 IC12.7 | LD1.K 157.48,5.08 SW1.1 | CN3.P33 CN3.P34 | CN4.P33 180.34,20.32 S1.3 | v179.07,68.58 179.07,62.23 CN4.P34 | IC4.1 v91.44,64.77 83.82,64.77 v82.55,66.04 | C9.2 110.49,102.87 IC5.1 | C7.2 74.93,63.5 IC3.1 68.58,66.04 54.61,80.01 49.53,80.01 39.37,90.17 | IC9.8 87.63,129.54 C11.2 | 39.37,90.17 38.1,90.17 C1.1 | 39.37,90.17 IC2.8 | v8.89,85.09 U$1.34 | 38.1,138.43 38.1,124.46 IC13.10
  pour Bottom: 203.2,203.2 0,203.2 0,0 203.2,0
  pour Top: 203.2,203.2 0,203.2 0,0 203.2,0
HALT*  (via drill 0.61)
  Top 0.254: CN1.P3 130.81,140.97 v130.81,135.89 v114.3,119.38 | CN3.P3 v125.73,69.85 | U$1.3 12.7,123.19 v36.83,147.32
  Bottom 0.254: v130.81,135.89 CN2.P3 | CN4.P3 140.97,57.15 138.43,57.15 v125.73,69.85 | v36.83,147.32 81.28,147.32 97.79,130.81 97.79,128.27 99.06,127 105.41,127 113.03,119.38 | 113.03,119.38 128.27,104.14 128.27,100.33 CN3.P3 | 113.03,119.38 v114.3,119.38
LOADREG  (via drill 0.61)
  Top 0.254: IC8.11 62.23,137.16 62.23,140.97 v83.82,162.56 | v90.17,156.21 93.98,156.21 104.14,166.37 IC7.11 116.84,180.34 IC10.3
  Bottom 0.254: v83.82,162.56 v90.17,156.21
LOADREG/  (via drill 0.61)
  Top 0.254: IC13.16 67.31,113.03 67.31,115.57 v69.85,118.11
  Bottom 0.254: v69.85,118.11 69.85,119.38 60.96,128.27 | 60.96,128.27 IC8.12 | 60.96,128.27 IC8.14
N$1  (via drill 0.61)
  Top 0.254: IC12.8 55.88,31.75 58.42,31.75 62.23,35.56 62.23,39.37 83.82,60.96 83.82,63.5 86.36,66.04 86.36,77.47 v91.44,82.55
  Bottom 0.254: v91.44,82.55 76.2,97.79 74.93,97.79 67.31,105.41 67.31,110.49 64.77,113.03 64.77,115.57 67.31,118.11 IC13.1
N$2
  Bottom 0.254: R9.2 127,21.59 LD1.A
N$3
  Top 0.254: R8.2 128.27,6.35 LD2.A
N$4
  Bottom 0.254: R7.2 97.79,27.94 91.44,21.59 107.95,5.08 LD3.A
N$5
  Top 0.406: 196.85,194.31 195.58,194.31 | 196.85,194.31 201.93,194.31 201.93,11.43 194.31,11.43 194.31,194.31 196.85,194.31
NMI*  (via drill 0.61)
  Top 0.254: v129.54,143.51 129.54,144.78 CN1.P4 | CN3.P4 129.54,78.74 v129.54,76.2 127,73.66 123.19,73.66 v110.49,60.96 | v52.07,92.71 54.61,92.71 v63.5,101.6 | CN2.P4 v123.19,110.49
  Bottom 0.254: CN2.P4 142.24,130.81 v129.54,143.51 | CN4.P4 142.24,63.5 v129.54,76.2 | U$1.4 15.24,123.19 29.21,109.22 31.75,109.22 35.56,105.41 38.1,105.41 49.53,93.98 50.8,93.98 v52.07,92.71 | v63.5,101.6 66.04,101.6 73.66,93.98 76.2,93.98 95.25,74.93 96.52,74.93 v110.49,60.96 | v123.19,110.49 CN3.P4
PWR_OK  (via drill 0.61)
  Top 0.254: R8.1 163.83,27.94 v193.04,57.15
  Bottom 0.254: v193.04,57.15 200.66,64.77 200.66,148.59 157.48,191.77 CN5.8
Q  (via drill 0.61)
  Top 0.254: v15.24,124.46 8.89,118.11 U$1.7
  Bottom 0.254: IC2.6 55.88,92.71 39.37,109.22 36.83,109.22 35.56,110.49 29.21,110.49 v15.24,124.46
R/W*  (via drill 0.61)
  Top 0.254: v49.53,68.58 IC2.14
  Bottom 0.254: v49.53,68.58 45.72,68.58 8.89,105.41 U$1.18
REGC0  (via drill 0.61)
  Top 0.254: v113.03,133.35 IC9.14 | v92.71,172.72 v83.82,163.83 IC8.5
  Bottom 0.254: v113.03,133.35 IC11.14 101.6,149.86 100.33,151.13 100.33,153.67 99.06,154.94 92.71,154.94 v83.82,163.83 | v92.71,172.72 92.71,173.99 90.17,176.53 | 90.17,176.53 IC6.12 | IC7.16 99.06,175.26 97.79,176.53 90.17,176.53
REGC1  (via drill 0.61)
  Top 0.254: IC6.10 88.9,177.8 88.9,179.07 92.71,182.88 93.98,181.61 93.98,180.34 IC7.6 v63.5,144.78
  Bottom 0.254: IC11.2 104.14,157.48 IC6.10 | 67.31,142.24 69.85,144.78 76.2,144.78 90.17,130.81 90.17,128.27 92.71,125.73 95.25,125.73 IC9.13 | IC8.3 67.31,142.24 | v63.5,144.78 64.77,144.78 67.31,142.24
REGS0  (via drill 0.61)
  Top 0.254: IC7.2 95.25,186.69 92.71,186.69 91.44,185.42 IC6.14 83.82,182.88 83.82,177.8 80.01,173.99 77.47,173.99 76.2,172.72 76.2,168.91 v73.66,166.37 | v64.77,116.84 67.31,116.84 v91.44,140.97
  Bottom 0.254: IC8.9 v64.77,116.84 | IC9.2 92.71,140.97 v91.44,140.97 90.17,142.24 90.17,146.05 73.66,162.56 v73.66,166.37
REGS1  (via drill 0.61)
  Top 0.254: 73.66,158.75 v85.09,170.18 | IC8.7 73.66,158.75 | 73.66,158.75 v72.39,158.75 | IC7.15 97.79,171.45 93.98,171.45 v88.9,166.37
  Bottom 0.254: IC6.6 85.09,171.45 v85.09,170.18 v88.9,166.37 | v72.39,158.75 IC9.3
RESET*  (via drill 0.61)
  Top 0.254: S2.1 171.45,8.89 176.53,8.89 S2.2 | v52.07,104.14 45.72,97.79 v35.56,97.79 | v11.43,121.92 10.16,121.92 8.89,120.65 U$1.5 | v69.85,99.06 62.23,91.44 62.23,88.9 63.5,87.63 IC2.2
  Bottom 0.254: v52.07,104.14 IC2.2 | v11.43,121.92 v35.56,97.79 | v69.85,99.06 73.66,95.25 76.2,95.25 93.98,77.47 95.25,77.47 157.48,15.24 157.48,10.16 161.29,6.35 163.83,8.89 170.18,8.89 S2.1
SCS0/  (via drill 0.61)
  Top 0.254: v158.75,181.61 153.67,181.61 113.03,140.97 110.49,140.97 IC9.4
  Bottom 0.254: v158.75,181.61 CN1.P36
SCS1/  (via drill 0.61)
  Top 0.254: v186.69,133.35 186.69,137.16 189.23,139.7 v189.23,151.13 | v162.56,185.42 156.21,185.42 113.03,142.24 109.22,142.24 IC9.5
  Bottom 0.254: CN2.P36 v186.69,133.35 | v189.23,151.13 189.23,158.75 v162.56,185.42
SCS2/  (via drill 0.61)
  Top 0.254: v149.86,118.11 148.59,118.11 v138.43,107.95 | v105.41,139.7 104.14,139.7 IC9.6
  Bottom 0.254: CN3.P36 181.61,92.71 175.26,92.71 v149.86,118.11 | v138.43,107.95 137.16,107.95 v105.41,139.7
SCS3/  (via drill 0.61)
  Top 0.254: v127,104.14 v144.78,121.92
  Bottom 0.254: CN4.P36 182.88,78.74 176.53,85.09 176.53,87.63 173.99,90.17 173.99,92.71 v144.78,121.92 | v127,104.14 106.68,124.46 97.79,124.46 95.25,127 93.98,127 IC9.7
SCS*  (via drill 0.61)
  Top 0.254: IC2.10 50.8,80.01 38.1,80.01 v26.67,68.58
  Bottom 0.254: v26.67,68.58 22.86,68.58 8.89,82.55 U$1.36
SLENB*  (via drill 0.61)
  Top 0.254: v20.32,67.31 57.15,104.14 63.5,104.14 IC13.18 v69.85,110.49 | CN1.P40 190.5,154.94 190.5,139.7 187.96,137.16 CN2.P40 191.77,125.73 v175.26,109.22 | CN3.P40 185.42,88.9 184.15,90.17 184.15,92.71 187.96,96.52 190.5,93.98 190.5,90.17 189.23,88.9 189.23,85.09 187.96,83.82 CN4.P40 189.23,59.69 189.23,54.61 166.37,31.75 v149.86,31.75
  Bottom 0.254: v20.32,67.31 19.05,67.31 8.89,77.47 U$1.40 | v175.26,109.22 175.26,104.14 CN3.P40 | v69.85,110.49 77.47,102.87 78.74,102.87 v149.86,31.75
SND  (via drill 0.61)
  Top 0.254: v179.07,139.7 179.07,148.59 CN1.P35 | U$1.35 22.86,82.55 v24.13,83.82 | v57.15,101.6 v31.75,76.2 | v82.55,80.01 86.36,80.01 v91.44,85.09 | v142.24,36.83 163.83,36.83 CN4.P35 | CN2.P35 182.88,119.38 v172.72,109.22
  Bottom 0.254: CN2.P35 182.88,127 181.61,128.27 181.61,137.16 v179.07,139.7 | CN4.P35 184.15,54.61 186.69,54.61 186.69,82.55 184.15,85.09 | 184.15,85.09 CN3.P35 | v31.75,76.2 v24.13,83.82 | v57.15,101.6 60.96,101.6 v82.55,80.01 | v91.44,85.09 93.98,85.09 v142.24,36.83 | v172.72,109.22 172.72,104.14 184.15,92.71 184.15,85.09
VCC  (via drill 0.61)
  Top 0.762: IC9.16 111.76,121.92 C13.1 111.76,127 v116.84,132.08 | IC11.15 IC11.16 111.76,144.78 C14.1 | IC10.10 IC10.11 IC10.12 IC10.13 IC10.14 | IC1.20 73.66,189.23 77.47,193.04 81.28,193.04 C10.1 | R5.2 104.14,163.83 115.57,175.26 115.57,176.53 116.84,177.8 IC10.4 | v24.13,129.54 22.86,129.54 8.89,115.57 U$1.9 | 109.22,97.79 114.3,97.79 C9.1 119.38,102.87 v119.38,106.68 | 109.22,97.79 IC5.16 | 109.22,97.79 96.52,85.09 C8.1 v92.71,68.58 | R9.1 R6.2 | IC12.14 74.93,29.21 C16.1 73.66,33.02 v80.01,39.37 | v73.66,135.89 IC8.16 68.58,129.54 57.15,118.11 48.26,118.11 44.45,114.3 v43.18,114.3 | IC3.16 72.39,55.88 C7.1 73.66,62.23 v80.01,68.58 | IC13.20 73.66,109.22 77.47,109.22 C17.1 82.55,111.76 v82.55,114.3 | IC2.16 72.39,82.55 C6.1 82.55,92.71 v82.55,95.25
  Bottom 0.762: R5.2 105.41,161.29 116.84,149.86 C14.1 | v116.84,132.08 116.84,134.62 IC11.16 | 124.46,177.8 IC10.11 124.46,177.8 | 124.46,177.8 IC10.4 | 124.46,177.8 119.38,182.88 IC10.2 113.03,182.88 104.14,191.77 | C15.1 123.19,187.96 IC10.14 | IC1.20 69.85,195.58 C5.1 | 86.36,194.31 86.36,195.58 C10.1 | 86.36,194.31 IC6.16 | 104.14,194.31 104.14,195.58 C12.1 | 104.14,191.77 104.14,194.31 | 104.14,191.77 IC7.20 | 104.14,194.31 86.36,194.31 | v24.13,129.54 C2.1 41.91,115.57 v43.18,114.3 | R9.1 85.09,21.59 C16.1 | v73.66,135.89 C11.1 | IC4.16 v92.71,68.58 82.55,78.74 81.28,78.74 78.74,81.28 76.2,81.28 C6.1 | v82.55,95.25 IC13.20 | v80.01,68.58 80.01,71.12 IC2.16 | IC8.16 68.58,128.27 v82.55,114.3 | v80.01,39.37 80.01,44.45 IC3.16 | IC9.16 106.68,119.38 v119.38,106.68

## Text on the board
Top: Copr. 12 May 2009 GIMEchip.com | http://www.GIMEchip.com/ | CC-Multi-Pak, Version 1.2 | +5VDC | PWR_OK | VCC | Power ON -> | RESET | Default Slot Select
tPlace: ATX Power Supply | C2 | 220uF | Copr. 12 May 2009 GIMEchip.com | CC BY-SA 4.0 License. | CC-Multi-Pak, Version 1.2 | +5VDC | PWR_OK | VCC | Power ON -> | RESET | Default Slot Select
bPlace: IN MEMORY OF: | ROBERT EMBRY TURNER | I LOVE YOU DADDY! | REST IN PEACE. | CC BY-SA 4.0 License.
_tsilk: http://www.GIMEchip.com/